# EAGLE schematic music bord (EAGLE 9.6.2)
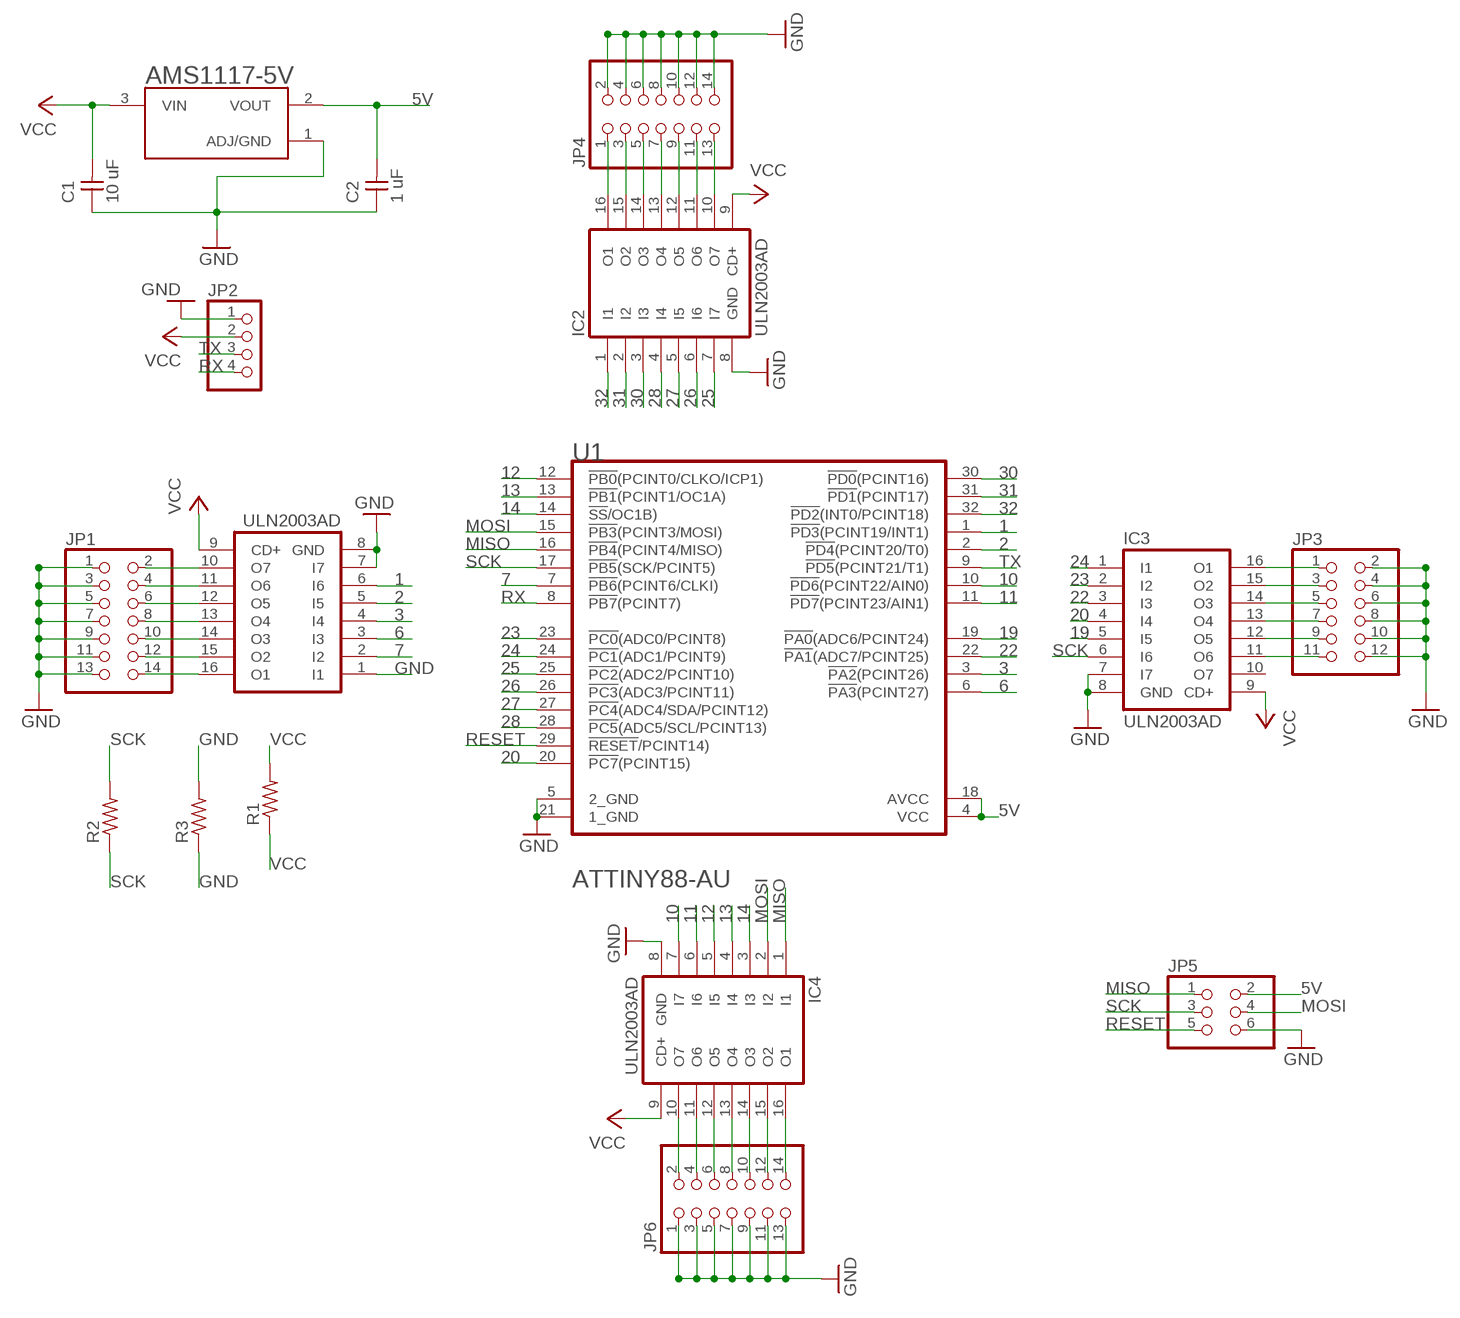
[diagram p0: schematic, sheet 1]

## Parts
AMS1117-5V  AMS1117-3.3  [SOT229P700X180-4N]
C1  10 uF  CAP_UNPOLARIZEDFAB  [C1206FAB]
C2  1 uF  CAP_UNPOLARIZEDFAB  [C1206FAB]
IC1  ULN2003AD  [SO16]
IC2  ULN2003AD  [SO16]
IC3  ULN2003AD  [SO16]
IC4  ULN2003AD  [SO16]
JP1  PINHD-2X7SMT  [2X07_SMT]
JP2  PINHD-1X4/90  [1X04/90]
JP3  PINHD-2X6SMT  [2X06_SMT]
JP4  PINHD-2X7SMT  [2X07_SMT]
JP5  CONN_03X2-PINHEAD-SMD  [2X03SMD]
JP6  PINHD-2X7SMT  [2X07_SMT]
R1  R1206FAB  [R1206FAB]
R2  R1206FAB  [R1206FAB]
R3  R1206FAB  [R1206FAB]
U1  MICROCHIP_-_ATMEL_ATTINY88-AUMICROCHIP_-_ATMEL_ATTINY88-AU_0_0  [MICROCHIP_-_ATMEL_ATTINY88-AU_0]

## Nets
1: IC1.6(I6) U1.1(!PD3!(PCINT19/INT1))
2: IC1.5(I5) U1.2(!PD4!(PCINT20/T0))
3: IC1.4(I4) U1.3(!PA2!(PCINT26))
5V: AMS1117-5V.2(VOUT) C2.2 JP5.2 U1.4(VCC) U1.18(AVCC)
6: IC1.3(I3) U1.6(!PA3!(PCINT27))
7: IC1.2(I2) U1.7(!PB6!(PCINT6/CLKI))
10: IC4.7(I7) U1.10(!PD6!(PCINT22/AIN0))
11: IC4.6(I6) U1.11(!PD7!(PCINT23/AIN1))
12: IC4.5(I5) U1.12(!PB0!(PCINT0/CLKO/ICP1))
13: IC4.4(I4) U1.13(!PB1!(PCINT1/OC1A))
14: IC4.3(I3) U1.14(!SS!/OC1B))
19: IC3.5(I5) U1.19(!PA0!(ADC6/PCINT24))
20: IC3.4(I4) U1.20(!PC7!(PCINT15))
22: IC3.3(I3) U1.22(!PA1!(ADC7/PCINT25))
23: IC3.2(I2) U1.23(!PC0!(ADC0/PCINT8))
24: IC3.1(I1) U1.24(!PC1!(ADC1/PCINT9))
25: IC2.7(I7) U1.25(!PC2!(ADC2/PCINT10))
26: IC2.6(I6) U1.26(!PC3!(ADC3/PCINT11))
27: IC2.5(I5) U1.27(!PC4!(ADC4/SDA/PCINT12))
28: IC2.4(I4) U1.28(!PC5!(ADC5/SCL/PCINT13))
30: IC2.3(I3) U1.30(!PD0!(PCINT16))
31: IC2.2(I2) U1.31(!PD1!(PCINT17))
32: IC2.1(I1) U1.32(!PD2!(INT0/PCINT18))
GND: AMS1117-5V.1(ADJ/GND) C1.1 C2.1 IC1.1(I1) IC1.7(I7) IC1.8(GND) IC2.8(GND) IC3.7(I7) IC3.8(GND) IC4.8(GND) JP1.1 JP1.3 JP1.5 JP1.7 JP1.9 JP1.11 JP1.13 JP2.1 JP3.2 JP3.4 JP3.6 JP3.8 JP3.10 JP3.12 JP4.2 JP4.4 JP4.6 JP4.8 JP4.10 JP4.12 JP4.14 JP5.6 JP6.1 JP6.3 JP6.5 JP6.7 JP6.9 JP6.11 JP6.13 R3.1 R3.2 U1.5(2_GND) U1.21(1_GND)
MISO: IC4.1(I1) JP5.1 U1.16(!PB4!(PCINT4/MISO))
MOSI: IC4.2(I2) JP5.4 U1.15(!PB3!(PCINT3/MOSI))
N$1: IC1.10(O7) JP1.2
N$2: IC4.10(O7) JP6.2
N$3: IC4.11(O6) JP6.4
N$4: IC4.12(O5) JP6.6
N$5: IC4.13(O4) JP6.8
N$6: IC4.14(O3) JP6.10
N$7: IC4.15(O2) JP6.12
N$8: IC4.16(O1) JP6.14
N$9: IC1.16(O1) JP1.14
N$10: IC3.16(O1) JP3.1
N$11: IC3.15(O2) JP3.3
N$12: IC3.14(O3) JP3.5
N$13: IC3.13(O4) JP3.7
N$14: IC3.12(O5) JP3.9
N$15: IC3.11(O6) JP3.11
N$16: IC2.16(O1) JP4.1
N$17: IC2.15(O2) JP4.3
N$18: IC2.14(O3) JP4.5
N$19: IC2.13(O4) JP4.7
N$20: IC2.12(O5) JP4.9
N$21: IC2.11(O6) JP4.11
N$22: IC2.10(O7) JP4.13
N$24: IC1.11(O6) JP1.4
N$25: IC1.12(O5) JP1.6
N$26: IC1.13(O4) JP1.8
N$27: IC1.14(O3) JP1.10
N$29: IC1.15(O2) JP1.12
RESET: JP5.5 U1.29(!RESET!/PCINT14))
RX: JP2.4 U1.8(!PB7!(PCINT7))
SCK: IC3.6(I6) JP5.3 R2.1 R2.2 U1.17(!PB5!(SCK/PCINT5))
TX: JP2.3 U1.9(!PD5!(PCINT21/T1))
VCC: AMS1117-5V.3(VIN) C1.2 IC1.9(CD+) IC2.9(CD+) IC3.9(CD+) IC4.9(CD+) JP2.2 R1.1 R1.2
Unconnected: IC3.10(O7)

## Library data of the parts
AMS1117-5V = AMS1117-3.3:AMS1117-3.3: Sot223/Pkg 1-Amp 3.3-Volt Low Drop Out Voltage Regulatator Check availability <https://pricing.snapeda.com/parts/AMS1117-3.3/Advanced%20Monolithic%20Systems/view-part?ref=eda>; AVAILABILITY: In Stock; DESCRIPTION: Sot223/Pkg 1-Amp 3.3-Volt Low Drop Out Voltage Regulatator; MF: Advanced Monolithic Systems; MP: AMS1117-3.3; PACKAGE: SOT-223 Seeed Technology; PRICE: None
C1 C2 = fab:CAP_UNPOLARIZED
IC1-IC4 = uln-udn:ULN2003A: DRIVER ARRAY
JP1 JP4 JP6 = pinhead+:PINHD-2X7: PIN HEADER
JP2 = pinhead:PINHD-1X4: PIN HEADER
JP3 = pinhead+:PINHD-2X6: PIN HEADER
JP5 = fab:CONN_03X2-PINHEAD-SMD: PIN HEADER
R1-R3 = fab:R: Resistor (US Symbol) Variants with postfix FAB are widened to allow the routing of internal traces
U1 = Atmel - ATTINY88-AU:MICROCHIP_-_ATMEL_ATTINY88-AU: MC-8B-ATT48-SQ32; CIIVA_IDS: 1155400; CODE__JEDEC: MS-026-ABA; COMPONENT_LINK_1_DESCRIPTION: Manufacturer URL; COMPONENT_LINK_1_URL: http://www.atmel.com/; COMPONENT_LINK_2_DESCRIPTION: ATtiny48/88 Datasheet; COMPONENT_LINK_2_URL: http://www.atmel.com/dyn/resources/prod_documents/doc8008.pdf; COMPONENT_LINK_3_DESCRIPTION: ATtiny48/88 Summary; COMPONENT_LINK_3_URL: http://www.atmel.com/dyn/resources/prod_documents/8008S.pdf; DATASHEET_VERSION: revC, Mar-2009; FOOTPRINT_VARIANT_NAME_0: Level C; FOOTPRINT_VARIANT_NAME_1: Level B; FOOTPRINT_VARIANT_NAME_2: Level A; IMPORTED: yes; IMPORTED_FROM: vault; IMPORT_TS: 1521843945; MF: Microchip / Atmel; MPN: ATTINY88-AU; PACKAGE: 32A; PACKAGE_DESCRIPTION: 32-Lead, 7x7x1.0 mm Body, 0.8mm Lead Pitch, Thin Profile Plastic Quad Flat Package (TQFP); PACKAGE_VERSION: revC, Oct-2010; PREFIX: U; RELEASE_DATE: 1329220623; VAULT_GUID: 2DDE0CE0-C8F3-4319-BD7A-FB53AA627F1B; VAULT_REVISION: 4BE95B8B-E1EF-4025-9FFB-95CA84512F43

## Net classes
0 default: clearance 0.205 mm